# EAGLE design StellarisCAN (EAGLE 6.4)
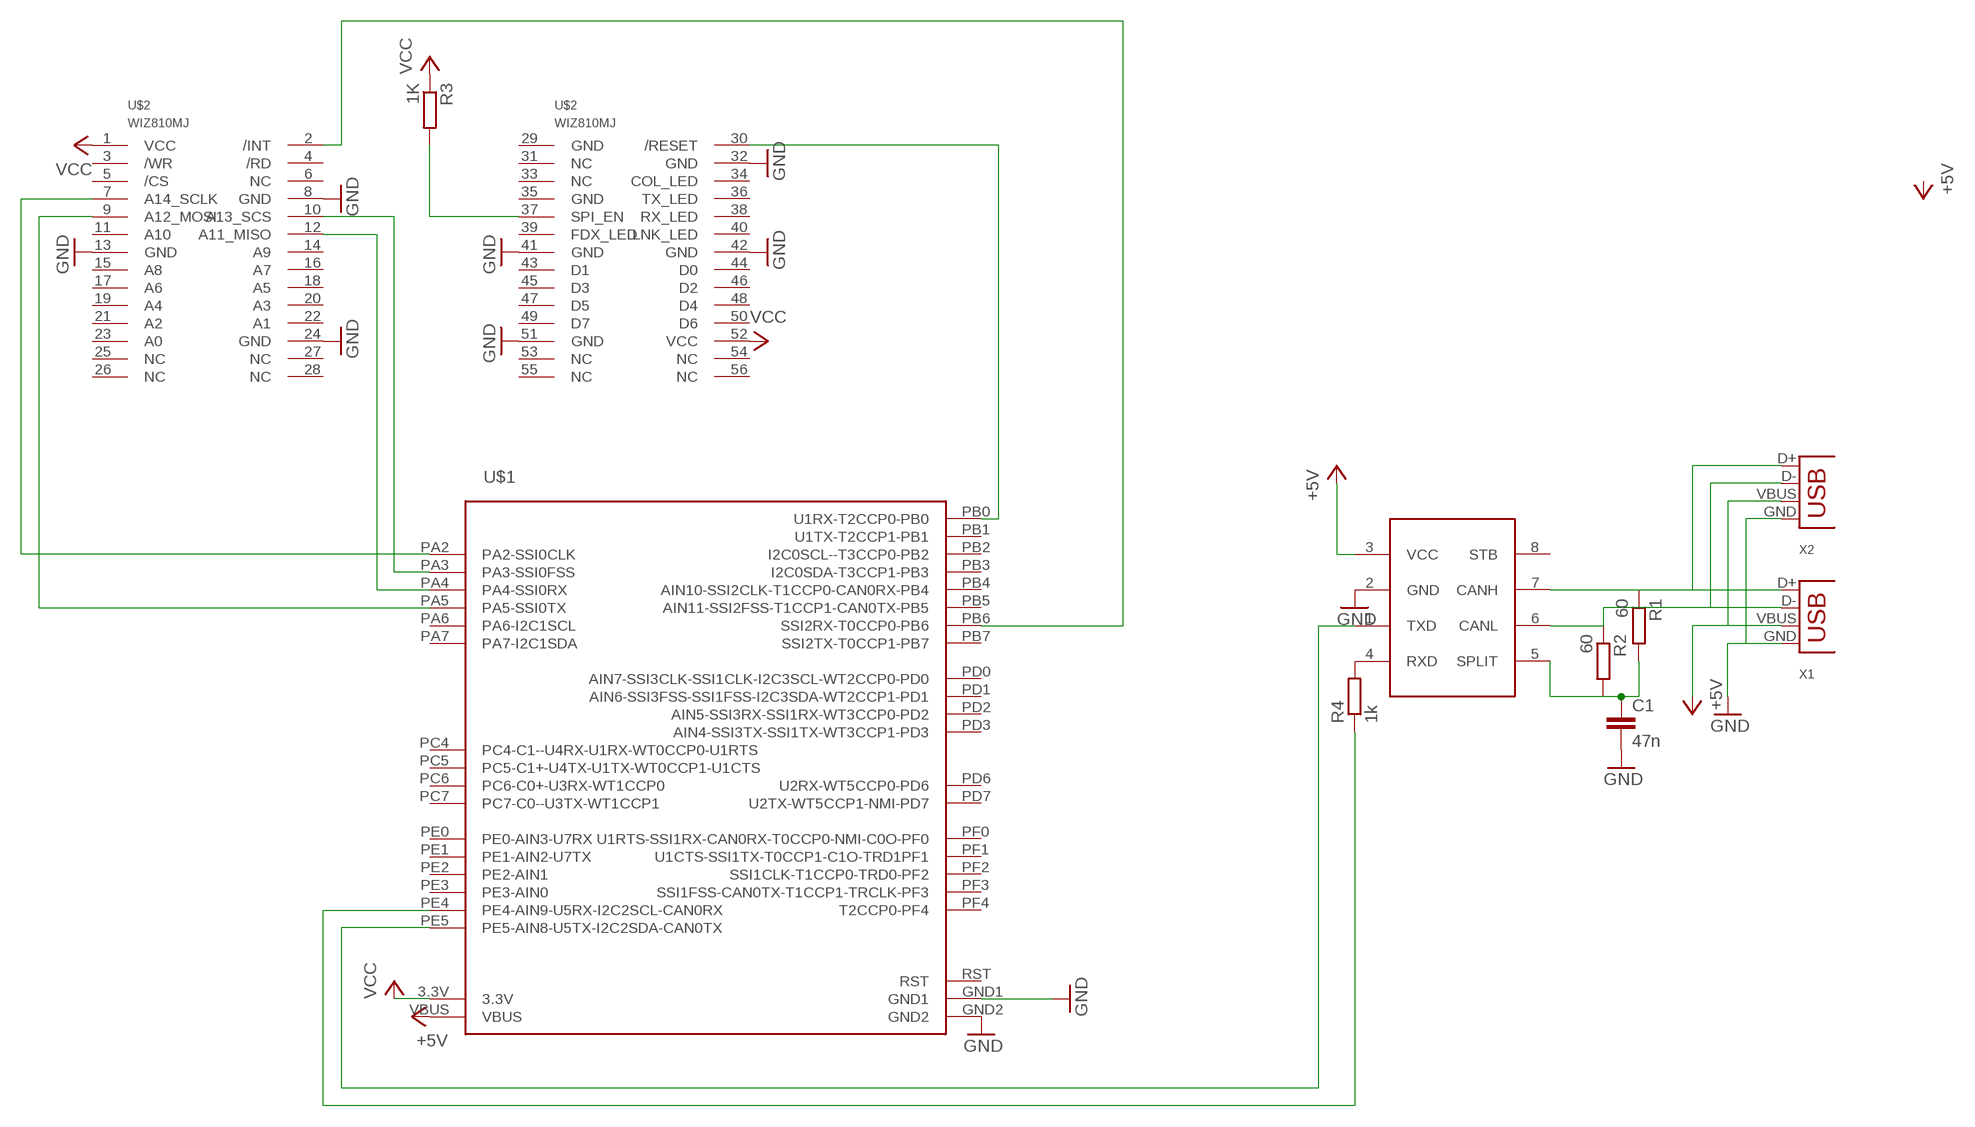
[diagram p0: schematic, sheet 1]

## Parts
C1  47n  C-EU025-040X050  [C025-040X050]
R1  60  R-EU_0207/7  [0207/7]
R2  60  R-EU_0207/7  [0207/7]
R3  1K  R-EU_0207/7  [0207/7]
R4  1k  R-EU_0207/7  [0207/7]
U$1  STELLARIS-LAUNCHPADSTELLARIS-LAUNCHPAD-XL  [LAUNCHPAD-XL]
U$2  WIZ810MJ  [WIZ810MJ]
U$3  TJA1040  [SOIC8-N_MC]
X1  USB-A-H  [USB-A-H]
X2  USB-B-H  [USB-B-H]

## Nets
+5V: U$1.VBUS U$3.3(VCC) X1.VBUS X2.VBUS
GND: C1.2 U$1.GND1 U$1.GND2 U$2.8(GND) U$2.13(GND) U$2.24(GND) U$2.32(GND) U$2.41(GND) U$2.42(GND) U$2.51(GND) U$3.2(GND) X1.GND X2.GND
N$1: U$1.PB0(U1RX-T2CCP0-PB0) U$2.30(/RESET)
N$2: R4.2 U$3.4(RXD)
N$3: U$1.PA2(PA2-SSI0CLK) U$2.7(A14_SCLK)
N$4: R4.1 U$1.PE4(PE4-AIN9-U5RX-I2C2SCL-CAN0RX)
N$5: R1.1 U$3.7(CANH) X1.D+ X2.D+
N$6: U$1.PA5(PA5-SSI0TX) U$2.9(A12_MOSI)
N$7: U$1.PE5(PE5-AIN8-U5TX-I2C2SDA-CAN0TX) U$3.1(TXD)
N$8: U$1.PA4(PA4-SSI0RX) U$2.12(A11_MISO)
N$9: U$1.PA3(PA3-SSI0FSS) U$2.10(A13_SCS)
N$10: R3.2 U$2.37(SPI_EN)
N$11: C1.1 R1.2 R2.2 U$3.5(SPLIT)
N$12: R2.1 U$3.6(CANL) X1.D- X2.D-
N$13: U$1.PB6(SSI2RX-T0CCP0-PB6) U$2.2(/INT)
VCC: R3.1 U$2.1(VCC) U$2.52(VCC)
Unconnected: U$1.PA6(PA6-I2C1SCL) U$1.PA7(PA7-I2C1SDA) U$1.PB1(U1TX-T2CCP1-PB1) U$1.PB2(I2C0SCL--T3CCP0-PB2) U$1.PB3(I2C0SDA-T3CCP1-PB3) U$1.PB4(AIN10-SSI2CLK-T1CCP0-CAN0RX-PB4) U$1.PB5(AIN11-SSI2FSS-T1CCP1-CAN0TX-PB5) U$1.PB7(SSI2TX-T0CCP1-PB7) U$1.PC4(PC4-C1--U4RX-U1RX-WT0CCP0-U1RTS) U$1.PC5(PC5-C1+-U4TX-U1TX-WT0CCP1-U1CTS) U$1.PC6(PC6-C0+-U3RX-WT1CCP0) U$1.PC7(PC7-C0--U3TX-WT1CCP1) U$1.PD0(AIN7-SSI3CLK-SSI1CLK-I2C3SCL-WT2CCP0-PD0) U$1.PD1(AIN6-SSI3FSS-SSI1FSS-I2C3SDA-WT2CCP1-PD1) U$1.PD2(AIN5-SSI3RX-SSI1RX-WT3CCP0-PD2) U$1.PD3(AIN4-SSI3TX-SSI1TX-WT3CCP1-PD3) U$1.PD6(U2RX-WT5CCP0-PD6) U$1.PD7(U2TX-WT5CCP1-NMI-PD7) U$1.PE0(PE0-AIN3-U7RX) U$1.PE1(PE1-AIN2-U7TX) U$1.PE2(PE2-AIN1) U$1.PE3(PE3-AIN0) U$1.PF0(U1RTS-SSI1RX-CAN0RX-T0CCP0-NMI-C0O-PF0) U$1.PF1(U1CTS-SSI1TX-T0CCP1-C1O-TRD1PF1) U$1.PF2(SSI1CLK-T1CCP0-TRD0-PF2) U$1.PF3(SSI1FSS-CAN0TX-T1CCP1-TRCLK-PF3) U$1.PF4(T2CCP0-PF4) U$2.3(/WR) U$2.4(/RD) U$2.5(/CS) U$2.6(NC) U$2.11(A10) U$2.14(A9) U$2.15(A8) U$2.16(A7) U$2.17(A6) U$2.18(A5) U$2.19(A4) U$2.20(A3) U$2.21(A2) U$2.22(A1) U$2.23(A0) U$2.25(NC) U$2.26(NC) U$2.27(NC) U$2.28(NC) U$2.29(GND) U$2.31(NC) U$2.33(NC) U$2.34(COL_LED) U$2.35(GND) U$2.36(TX_LED) U$2.38(RX_LED) U$2.39(FDX_LED) U$2.40(LNK_LED) U$2.43(D1) U$2.44(D0) U$2.45(D3) U$2.46(D2) U$2.47(D5) U$2.48(D4) U$2.49(D7) U$2.50(D6) U$2.53(NC) U$2.54(NC) U$2.55(NC) U$2.56(NC) U$3.8(STB)

## Power pins joined to a net without a drawn wire
3.3V: U$1.3.3V
RST: U$1.RST

## Library data of the parts
C1 = rcl:C-EU: CAPACITOR, European symbol
R1-R4 = rcl:R-EU_: RESISTOR, European symbol
U$1 = lieven:STELLARIS-LAUNCHPAD
U$2 = WIZNET:WIZ810MJ
U$3 = lieven:TJA1040
X1 X2 = lieven:USB: USB Connectors

## Board
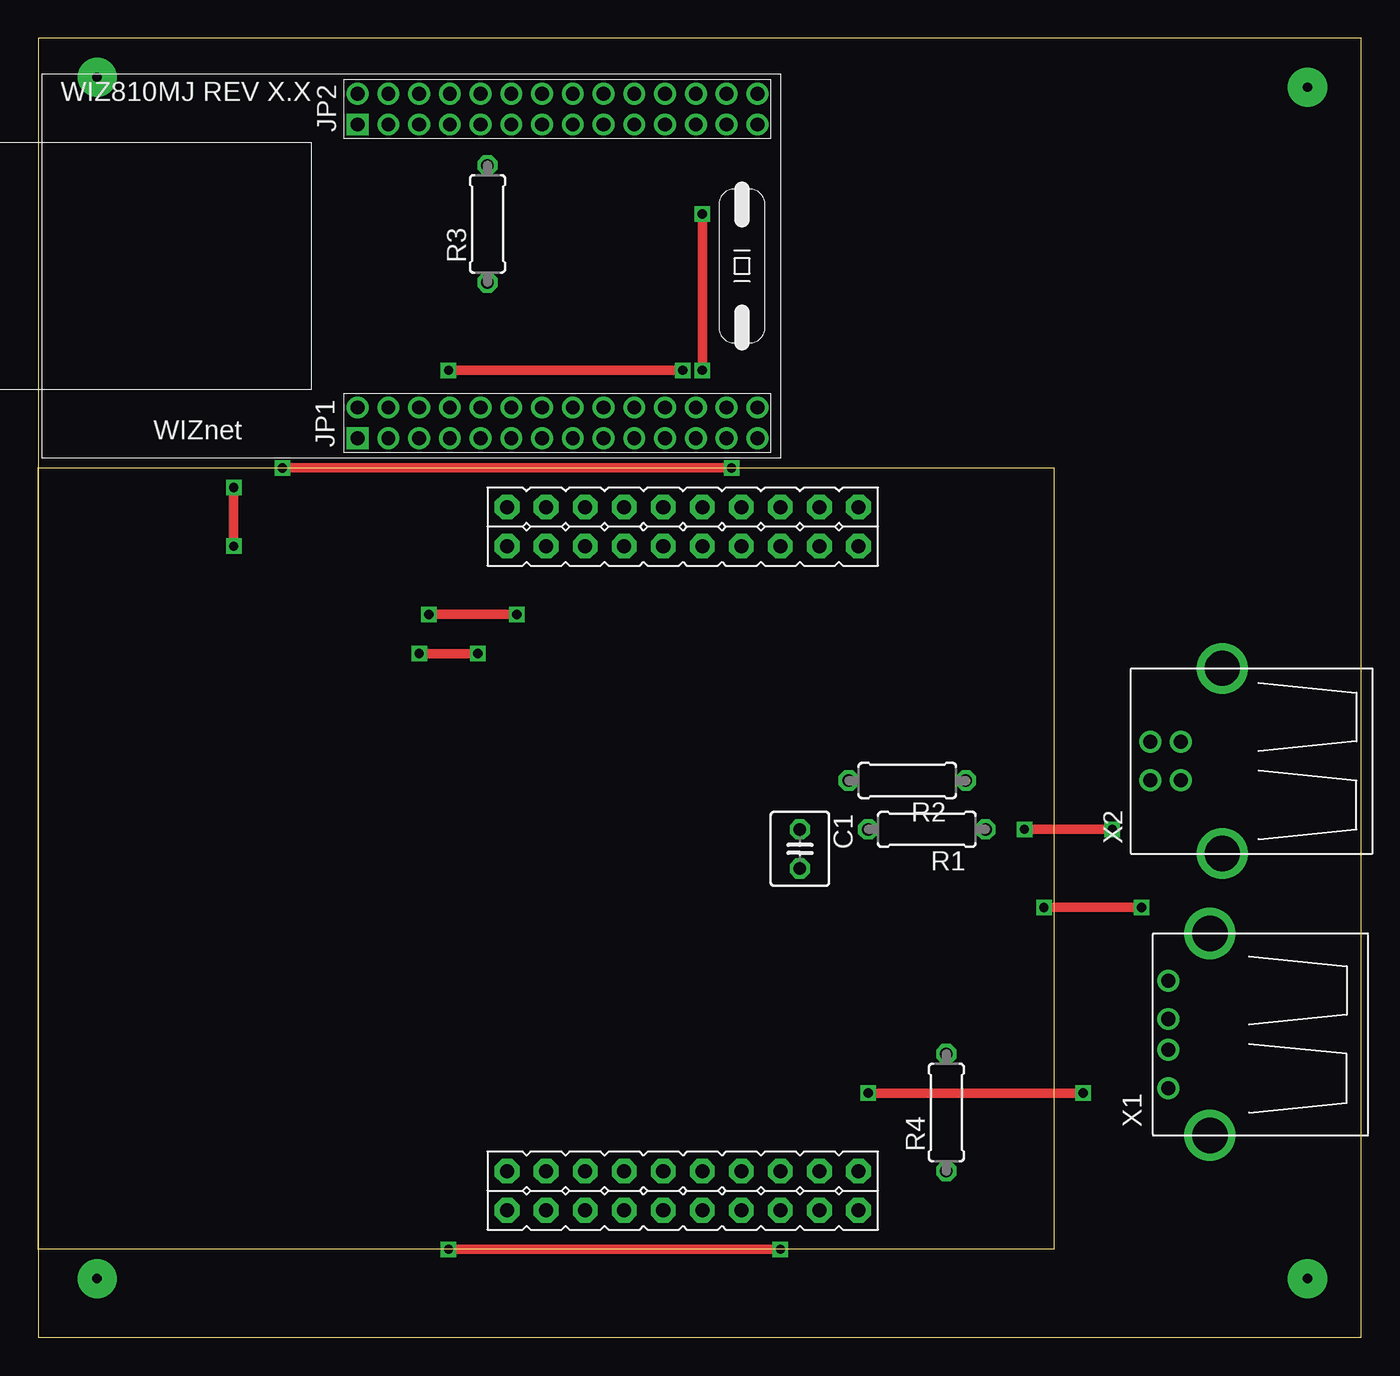
[diagram p1: board, top side]
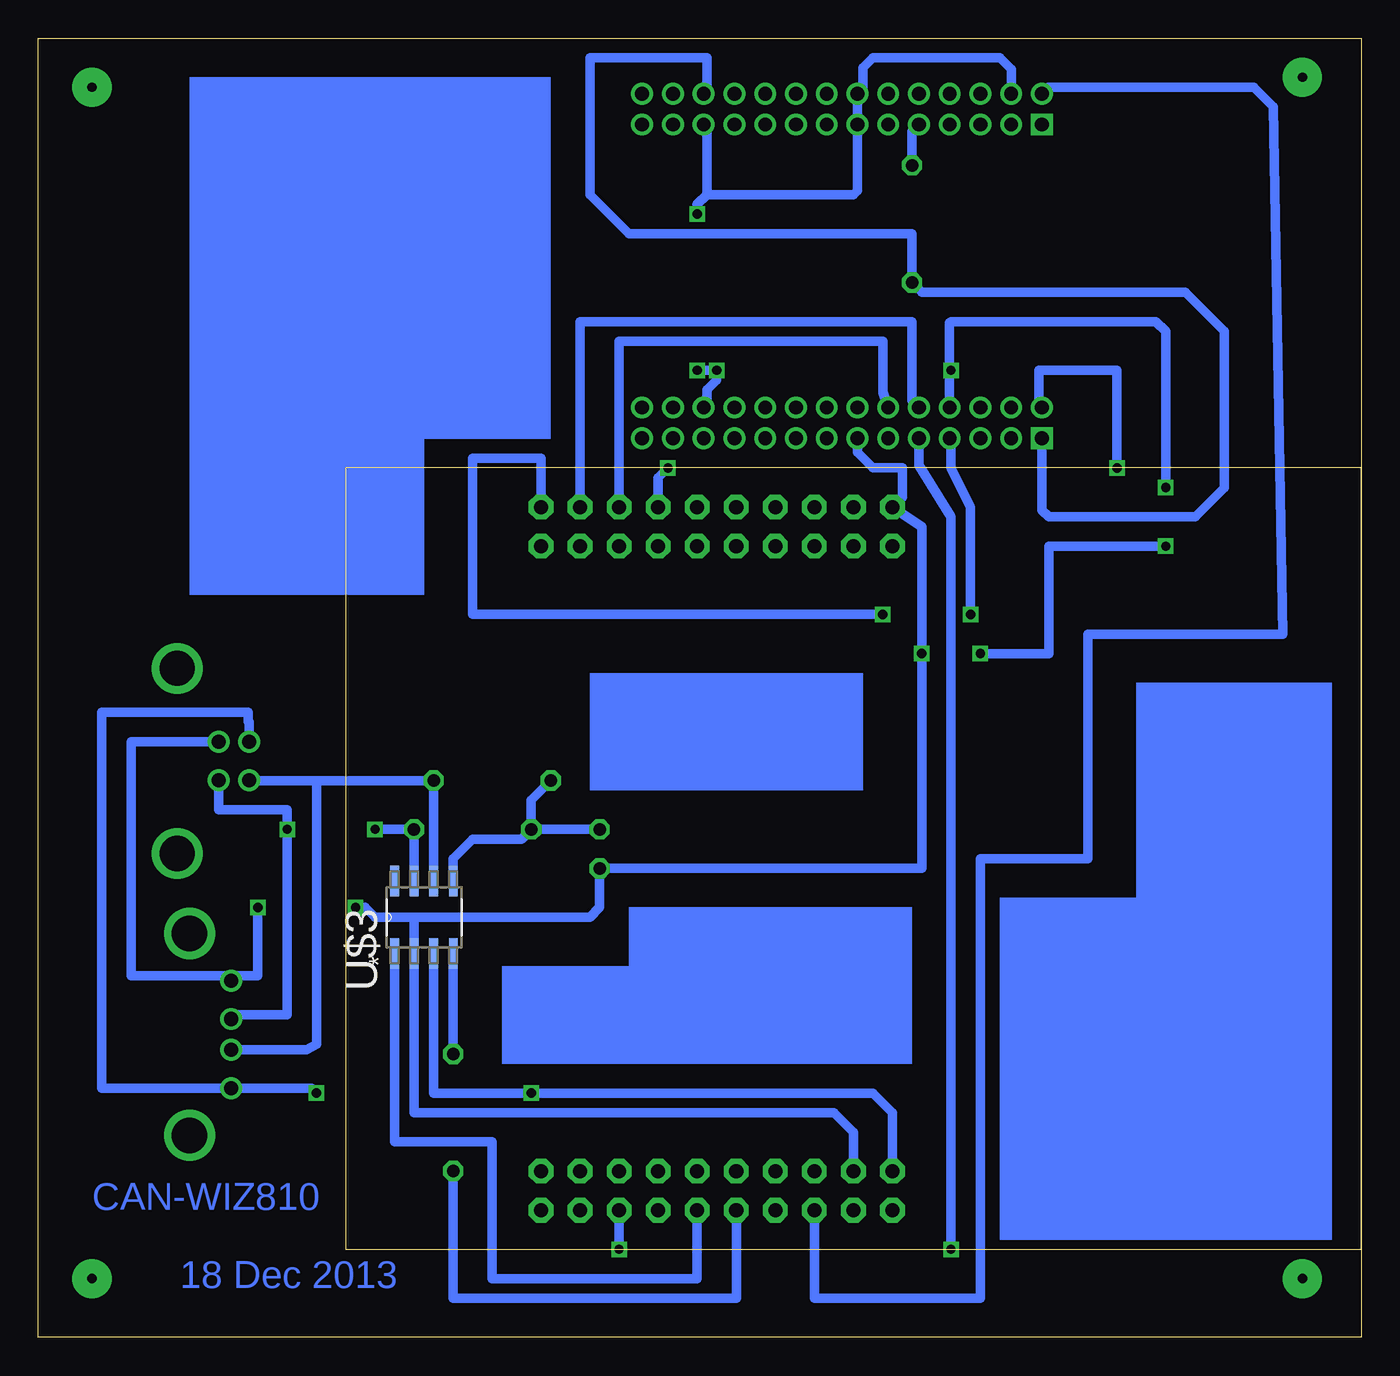
[diagram p2: board, bottom side, seen from below]

Size 86.03 x 84.44 mm. Coordinates in mm from the lower left corner, seen from the top.
Outline: 0,0 86.03,0 86.03,84.44 0,84.44 0,0
Copper layers (1*16): Top 0.035mm / dielectric 1.5mm / Bottom 0.035mm
Design rules "default": minimum track width 10mil, minimum drill 24mil, track to track 8mil, track to pad 8mil, pad to pad 8mil, via to via 8mil, smd to smd 8mil, copper to edge 40mil, drill to drill 8mil, minimum pad ring 10mil, minimum via ring 8mil, stop-mask expansion 4mil, vias tented up to drill 0mil, thermal gap 10mil

### Footprints (pad centres in the part's own frame; a part is rotated, then mirrored left to right if it is on the bottom)
C025-040X050 = drill 0.813 octagon: 1 -1.27,0; 2 1.27,0
0207/7 = drill 0.813 octagon: 1 -3.81,0; 2 3.81,0
LAUNCHPAD-XL = drill 0.914 pad 1.6 octagon: 3.3V 30.48,2.54; GND1 33.02,5.08; GND2 30.48,48.26; PA2 53.34,48.26; PA3 50.8,48.26; PA4 48.26,48.26; PA5 48.26,2.54; PA6 50.8,2.54; PA7 53.34,2.54; PB0 35.56,2.54; PB1 38.1,2.54; PB2 33.02,48.26; PB3 35.56,45.72; PB4 45.72,2.54; PB5 33.02,2.54; PB6 45.72,48.26; PB7 43.18,48.26; PC4 38.1,45.72; PC5 40.64,45.72; PC6 43.18,45.72; PC7 45.72,45.72; PD0 35.56,5.08; PD1 38.1,5.08; PD2 40.64,5.08; PD3 43.18,5.08; PD6 48.26,45.72; PD7 50.8,45.72; PE0 35.56,48.26; PE1 45.72,5.08; PE2 48.26,5.08; PE3 50.8,5.08; PE4 40.64,2.54; PE5 43.18,2.54; PF0 38.1,48.26; PF1 53.34,5.08; PF2 30.48,45.72; PF3 33.02,45.72; PF4 53.34,45.72; RST 40.64,48.26; VBUS 30.48,5.08
WIZ810MJ = drill 0.9 pad 1.422 square: 1 27.5,-1.3; 29 27.5,-21.7 | drill 0.9 pad 1.422: 2 27.5,-3.3; 3 25.5,-1.3; 4 25.5,-3.3; 5 23.5,-1.3; 6 23.5,-3.3; 7 21.5,-1.3; 8 21.5,-3.3; 9 19.5,-1.3; 10 19.5,-3.3; 11 17.5,-1.3; 12 17.5,-3.3; 13 15.5,-1.3; 14 15.5,-3.3; 15 13.5,-1.3; 16 13.5,-3.3; 17 11.5,-1.3; 18 11.5,-3.3; 19 9.5,-1.3; 20 9.5,-3.3; 21 7.5,-1.3; 22 7.5,-3.3; 23 5.5,-1.3; 24 5.5,-3.3; 25 3.5,-1.3; 26 3.5,-3.3; 27 1.5,-1.3; 28 1.5,-3.3; 30 27.5,-23.7; 31 25.5,-21.7; 32 25.5,-23.7; 33 23.5,-21.7; 34 23.5,-23.7; 35 21.5,-21.7; 36 21.5,-23.7; 37 19.5,-21.7; 38 19.5,-23.7; 39 17.5,-21.7; 40 17.5,-23.7; 41 15.5,-21.7; 42 15.5,-23.7; 43 13.5,-21.7; 44 13.5,-23.7; 45 11.5,-21.7; 46 11.5,-23.7; 47 9.5,-21.7; 48 9.5,-23.7; 49 7.5,-21.7; 50 7.5,-23.7; 51 5.5,-21.7; 52 5.5,-23.7; 53 3.5,-21.7; 54 3.5,-23.7; 55 1.5,-21.7; 56 1.5,-23.7
SOIC8-N_MC = smd 1.981 x 0.559: 1 -2.362,1.905; 2 -2.362,0.635; 3 -2.362,-0.635; 4 -2.362,-1.905; 5 2.362,-1.905; 6 2.362,-0.635; 7 2.362,0.635; 8 2.362,1.905
USB-A-H = drill 0.914: D+ 2.718,-1.003; D- 2.718,1.003; GND 2.718,-3.493; VBUS 2.718,3.493 | drill 2.311: P$5 0,-6.566; P$6 0,6.566
USB-B-H = drill 0.914: D+ 0,1.25; D- 1.981,1.25; GND 0,-1.25; VBUS 1.981,-1.25 | drill 2.286: P$1 -2.718,-6.02; P$2 -2.718,6.02

### Placement (x,y rotation side)
C1  49.53,31.75 270 top
R1  57.78,33.02 180 top
R2  56.52,36.2 180 top
R3  29.21,72.39 90 top
R4  59.05,14.61 90 top
U$1  0,5.71 0 top
U$2  48.26,57.15 180 top
U$3  60.96,27.3 90 bottom
X1  76.2,19.68 180 top
X2  74.3,37.47 180 top

### Tracks (layer width: path | path; a pad name or v marks a point on that pad's centre or on a via)
+5V  (via drill 0.6)
  Top 0.61: v67.94,15.88 v53.98,15.88
  Bottom 0.61: X2.VBUS 72.31,40.01 72.39,40.01 72.39,40.64 81.92,40.64 81.92,16.19 X1.VBUS 68.26,16.19 v67.94,15.88 | U$3.3 60.33,15.88 v53.98,15.88 31.75,15.88 30.48,14.61 U$1.VBUS
GND  (via drill 0.6)
  Top 0.61: v26.67,62.87 v41.91,62.87 | v43.18,62.87 v43.18,73.03 | v71.75,27.94 v65.41,27.94 | v12.7,55.24 v12.7,51.44 | v24.77,44.45 v28.57,44.45
  Bottom 0.61: X2.GND 80.01,38.72 80.01,23.5 73.48,23.5 | 73.48,23.5 X1.GND | U$1.GND1 33.02,13.34 34.29,14.61 61.59,14.61 U$3.2 61.59,27.3 | 61.59,27.3 50.16,27.3 49.53,27.94 C1.2 28.57,30.48 v28.57,44.45 28.57,52.7 U$1.GND2 29.84,54.61 29.84,56.52 31.75,56.52 32.76,57.52 U$2.13 | U$2.32 22.76,82.45 23.5,83.19 31.75,83.19 32.38,82.55 32.38,81.22 U$2.42 U$2.41 32.76,74.56 33.02,74.3 42.55,74.3 | 42.55,74.3 42.55,78.64 U$2.51 | v26.67,62.87 26.76,62.77 U$2.8 26.76,65.95 26.67,66.04 13.34,66.04 12.7,65.41 v12.7,55.24 | U$2.24 42.55,60.66 42.55,61.59 41.91,62.23 v41.91,62.87 v43.18,62.87 | v43.18,73.03 43.18,73.66 42.55,74.3 | 73.48,23.5 71.75,23.5 v71.75,27.94 | v65.41,27.94 64.77,27.94 64.14,27.3 61.59,27.3 | v12.7,51.44 20.32,51.44 20.32,44.45 v24.77,44.45
N$1
  Bottom 0.61: U$1.PB0 35.56,2.54 24.77,2.54 24.77,31.11 17.78,31.11 17.78,45.72 5.08,45.72 5.71,80.01 6.99,81.28 20.33,81.28 U$2.30
N$2
  Bottom 0.61: R4.2 U$3.4
N$3  (via drill 0.6)
  Top 0.61: v31.11,46.99 v25.4,46.99
  Bottom 0.61: U$1.PA2 53.34,57.15 57.78,57.15 57.78,46.99 v31.11,46.99 | v25.4,46.99 25.4,53.98 26.67,56.52 26.67,57.91 U$2.7
N$4
  Bottom 0.61: U$1.PE4 40.64,2.54 59.05,2.54 R4.1
N$5  (via drill 0.6)
  Top 0.61: v64.14,33.02 v69.85,33.02
  Bottom 0.61: X2.D+ 74.3,34.29 69.85,34.29 v69.85,33.02 69.85,20.95 73.48,20.95 X1.D+ | v64.14,33.02 R1.1 U$3.7
N$6  (via drill 0.6)
  Top 0.61: v48.26,5.71 v26.67,5.71
  Bottom 0.61: U$2.9 28.76,56.7 26.67,53.34 v26.67,5.71 | U$1.PA5 v48.26,5.71
N$7
  Bottom 0.61: U$1.PE5 43.18,3.81 56.52,3.81 56.52,12.7 62.87,12.7 U$3.1
N$8
  Bottom 0.61: U$1.PA4 48.26,64.77 31.11,64.77 31.11,61.44 U$2.12
N$9
  Bottom 0.61: U$1.PA3 50.8,66.04 29.21,66.04 29.21,60.9 U$2.10
N$10
  Bottom 0.61: R3.2 29.21,78.4 U$2.37
N$11
  Bottom 0.61: U$3.5 59.05,31.11 57.78,32.38 54.61,32.38 R1.2 | R1.2 53.98,34.92 R2.2 | R1.2 C1.1
N$12
  Bottom 0.61: X1.D- 68.58,18.68 67.94,19.05 67.94,36.2 | 67.94,36.2 72.31,36.2 X2.D- | 67.94,36.2 R2.1 U$3.6
N$13  (via drill 0.6)
  Top 0.61: v45.09,56.52 v15.88,56.52
  Bottom 0.61: U$1.PB6 45.72,55.88 v45.09,56.52 | v15.88,56.52 15.88,62.87 20.95,62.87 20.95,60.65 U$2.2
N$14  (via drill 0.6 pad 2.54)
  other vias: 3.81,3.81
N$15  (via drill 0.6 pad 2.54)
  other vias: 82.55,3.81
N$16  (via drill 0.6 pad 2.54)
  other vias: 82.55,81.28
N$17  (via drill 0.6 pad 2.54)
  other vias: 3.81,81.92
VCC
  Bottom 0.61: U$2.1 20.76,53.78 20.32,53.34 10.79,53.34 8.89,55.24 8.89,65.41 11.43,67.94 28.57,67.94 R3.1 29.21,71.75 47.62,71.75 50.16,74.3 50.16,83.19 42.55,83.19 42.55,81.06 U$2.52
(copper drawn outside any net)
  shapes: Bottom area x8

### Text on the board
Bottom: CAN-WIZ810 | 18 Dec 2013